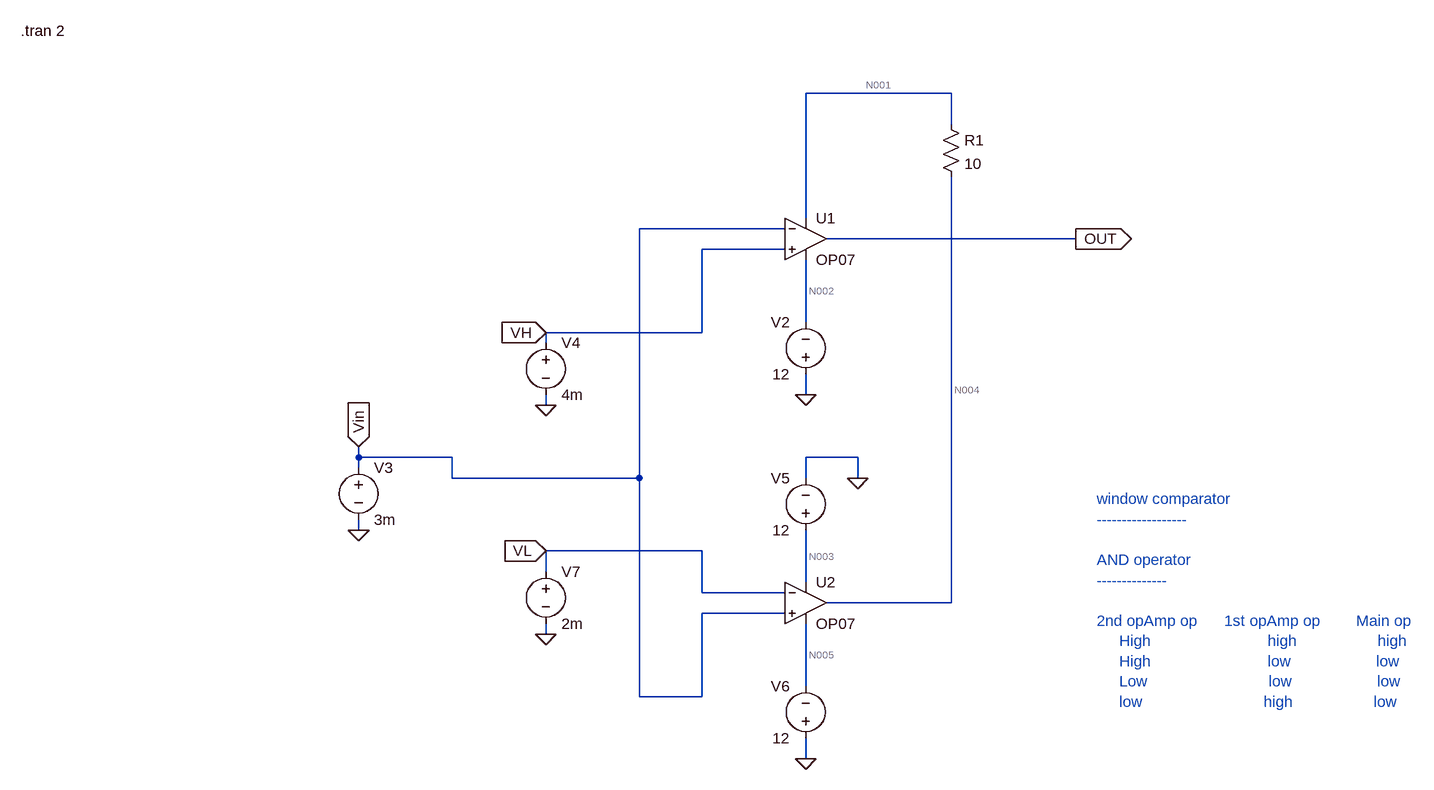
[diagram p0: schematic opAmp_as_Window_comparator.asc]
opAmp_as_Window_comparator.asc, the LTspice schematic file:
Version 4.1
SHEET 1 1224 1032
WIRE 480 -48 256 -48
WIRE 480 0 480 -48
WIRE 256 144 256 -48
WIRE 224 160 0 160
WIRE 672 176 288 176
WIRE 224 192 96 192
WIRE 256 304 256 208
WIRE 96 320 96 192
WIRE 96 320 -144 320
WIRE -144 336 -144 320
WIRE 256 416 256 384
WIRE -144 432 -144 416
WIRE -432 512 -432 496
WIRE -288 512 -432 512
WIRE 336 512 256 512
WIRE -432 528 -432 512
WIRE -288 544 -288 512
WIRE 0 544 0 160
WIRE 0 544 -288 544
WIRE 256 544 256 512
WIRE 336 544 336 512
WIRE -432 624 -432 608
WIRE 96 656 -144 656
WIRE -144 688 -144 656
WIRE 256 704 256 624
WIRE 96 720 96 656
WIRE 224 720 96 720
WIRE 480 736 480 80
WIRE 480 736 288 736
WIRE 224 752 96 752
WIRE -144 784 -144 768
WIRE 256 864 256 768
WIRE 0 880 0 544
WIRE 96 880 96 752
WIRE 96 880 0 880
WIRE 256 976 256 944
FLAG 256 416 0
FLAG -144 432 0
FLAG 672 176 OUT
IOPIN 672 176 Out
FLAG -144 320 VH
IOPIN -144 320 In
FLAG 336 544 0
FLAG 256 976 0
FLAG -144 784 0
FLAG -144 656 VL
IOPIN -144 656 In
FLAG -432 624 0
FLAG -432 496 Vin
IOPIN -432 496 In
SYMBOL OpAmps\\OP07 256 112 R0
SYMATTR InstName U1
SYMBOL voltage 256 400 R180
WINDOW 0 24 96 Left 2
WINDOW 3 24 16 Left 2
WINDOW 123 0 0 Left 0
WINDOW 39 0 0 Left 0
SYMATTR InstName V2
SYMATTR Value 12
SYMBOL voltage -144 320 R0
WINDOW 123 0 0 Left 0
WINDOW 39 0 0 Left 0
SYMATTR InstName V4
SYMATTR Value 4m
SYMBOL OpAmps\\OP07 256 672 R0
SYMATTR InstName U2
SYMBOL voltage 256 640 R180
WINDOW 0 24 96 Left 2
WINDOW 3 24 16 Left 2
WINDOW 123 0 0 Left 0
WINDOW 39 0 0 Left 0
SYMATTR InstName V5
SYMATTR Value 12
SYMBOL voltage 256 960 R180
WINDOW 0 24 96 Left 2
WINDOW 3 24 16 Left 2
WINDOW 123 0 0 Left 0
WINDOW 39 0 0 Left 0
SYMATTR InstName V6
SYMATTR Value 12
SYMBOL voltage -144 672 R0
WINDOW 123 0 0 Left 0
WINDOW 39 0 0 Left 0
SYMATTR InstName V7
SYMATTR Value 2m
SYMBOL voltage -432 512 R0
WINDOW 123 0 0 Left 0
WINDOW 39 0 0 Left 0
SYMATTR InstName V3
SYMATTR Value 3m
SYMBOL res 464 -16 R0
SYMATTR InstName R1
SYMATTR Value 10
TEXT -952 -144 Left 2 !.tran 2
TEXT 704 576 Left 2 ;window comparator\n------------------\n \nAND operator\n--------------\n \n2nd opAmp op      1st opAmp op        Main op\n     High                          high                  high\n     High                          low                   low\n     Low                           low                   low\n     low                           high                  low

The netlist it stands for:
* opAmp_as_Window_comparator.asc
X§U1 VH Vin N001 N002 OUT LT1001  ; OP07, pins In+ In- V+ V- OUT
V2 0 N002 12
V4 VH 0 4m
X§U2 Vin VL N003 N005 N004 LT1001  ; OP07, pins In+ In- V+ V- OUT
V5 N003 0 12
V6 0 N005 12
V7 VL 0 2m
V3 Vin 0 3m
R1 N001 N004 10
.tran 2
* window comparator
* ------------------
* AND operator
* --------------
* 2nd opAmp op      1st opAmp op        Main op
*      High                          high                  high
*      High                          low                   low
*      Low                           low                   low
*      low                           high                  low
.lib LTC.lib
.backanno
.end

* Results of the author's LTspice run, read from the files saved beside the schematic
* Operating Point, zero values left out:
*   V(vin) = 3 mV
*   V(n002) = -12 V
*   V(out) = 10.02 V
*   V(n003) = 12 V
*   V(vh) = 4 mV
*   V(n001) = 10.96 V
*   V(vl) = 2 mV
*   V(n005) = -12 V
*   V(n004) = 10.98 V
*   I(V7) = 13.5 pA
*   I(V2) = -2.25 mA
*   I(R1) = -2.25 mA
*   I(V5) = -3.515 mA
*   I(V4) = -14.44 pA
*   I(V6) = -1.266 mA
*   Ix(u2:1) = 13.51 pA
*   Ix(u2:2) = -13.5 pA
*   Ix(u2:3) = 3.515 mA
*   Ix(u2:4) = -1.266 mA
*   Ix(u2:5) = -2.25 mA
*   Ix(u1:1) = 14.44 pA
*   Ix(u1:2) = -12.57 pA
*   Ix(u1:3) = 2.25 mA
*   Ix(u1:4) = -2.25 mA
*   Ix(u1:5) = -21.08 pA